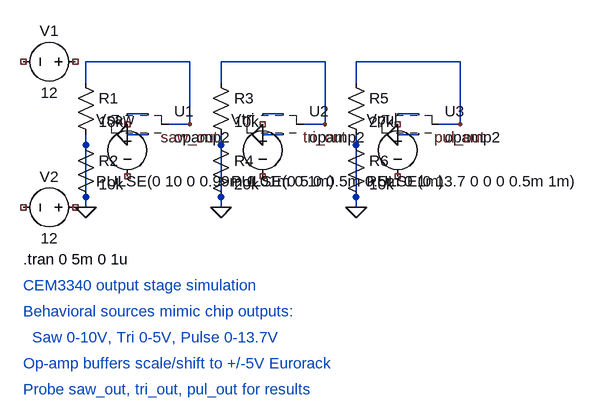
[diagram p0: schematic cem3340-output-stage.asc]
cem3340-output-stage.asc, the LTspice schematic file:
Version 4
SHEET 1 1600 900
WIRE 192 160 192 128
WIRE 192 272 192 240
WIRE 400 160 400 128
WIRE 400 272 400 240
WIRE 608 160 608 128
WIRE 608 272 608 240
WIRE 288 208 256 208
WIRE 288 240 256 240
WIRE 496 208 464 208
WIRE 496 240 464 240
WIRE 704 208 672 208
WIRE 704 240 672 240
WIRE 192 352 192 272
WIRE 400 352 400 272
WIRE 608 352 608 272
WIRE 352 224 320 224
WIRE 560 224 528 224
WIRE 768 224 736 224
WIRE 352 128 352 224
WIRE 352 128 192 128
WIRE 560 128 560 224
WIRE 560 128 400 128
WIRE 768 128 768 224
WIRE 768 128 608 128
FLAG 192 352 0
FLAG 400 352 0
FLAG 608 352 0
FLAG 256 240 0
FLAG 464 240 0
FLAG 672 240 0
FLAG 352 224 saw_out
FLAG 560 224 tri_out
FLAG 768 224 pul_out
SYMBOL opamp2 288 224 R0
SYMATTR InstName U1
SYMATTR Value2 Avol=100K GBW=3Meg Slew=13Meg
SYMBOL opamp2 496 224 R0
SYMATTR InstName U2
SYMATTR Value2 Avol=100K GBW=3Meg Slew=13Meg
SYMBOL opamp2 704 224 R0
SYMATTR InstName U3
SYMATTR Value2 Avol=100K GBW=3Meg Slew=13Meg
SYMBOL res 176 144 R0
SYMATTR InstName R1
SYMATTR Value 10k
SYMBOL res 176 240 R0
SYMATTR InstName R2
SYMATTR Value 10k
SYMBOL res 384 144 R0
SYMATTR InstName R3
SYMATTR Value 10k
SYMBOL res 384 240 R0
SYMATTR InstName R4
SYMATTR Value 20k
SYMBOL res 592 144 R0
SYMATTR InstName R5
SYMATTR Value 27k
SYMBOL res 592 240 R0
SYMATTR InstName R6
SYMATTR Value 10k
SYMBOL voltage 256 208 R0
WINDOW 0 -48 8 Left 2
WINDOW 3 -48 104 Left 2
SYMATTR InstName Vsaw
SYMATTR Value PULSE(0 10 0 0.99m 0.01m 0 1m)
SYMBOL voltage 464 208 R0
WINDOW 0 -48 8 Left 2
WINDOW 3 -48 104 Left 2
SYMATTR InstName Vtri
SYMATTR Value PULSE(0 5 0 0.5m 0.5m 0 1m)
SYMBOL voltage 672 208 R0
WINDOW 0 -48 8 Left 2
WINDOW 3 -48 104 Left 2
SYMATTR InstName Vpul
SYMATTR Value PULSE(0 13.7 0 0 0 0.5m 1m)
SYMBOL voltage 192 128 R90
WINDOW 0 -32 56 VBottom 2
WINDOW 3 32 56 VTop 2
SYMATTR InstName V1
SYMATTR Value 12
SYMBOL voltage 192 352 R90
WINDOW 0 -32 56 VBottom 2
WINDOW 3 32 56 VTop 2
SYMATTR InstName V2
SYMATTR Value 12
TEXT 96 432 Left 2 !.tran 0 5m 0 1u
TEXT 96 472 Left 2 ;CEM3340 output stage simulation
TEXT 96 512 Left 2 ;Behavioral sources mimic chip outputs:
TEXT 96 552 Left 2 ;  Saw 0-10V, Tri 0-5V, Pulse 0-13.7V
TEXT 96 592 Left 2 ;Op-amp buffers scale/shift to +/-5V Eurorack
TEXT 96 632 Left 2 ;Probe saw_out, tri_out, pul_out for results

The netlist it stands for:
* cem3340-output-stage.asc
* U1: Avol=100K GBW=3Meg Slew=13Meg (symbol opamp2 not available, pin order unknown); nets seen at it: 0, N001, saw_out
* U2: Avol=100K GBW=3Meg Slew=13Meg (symbol opamp2 not available, pin order unknown); nets seen at it: 0, N002, tri_out
* U3: Avol=100K GBW=3Meg Slew=13Meg (symbol opamp2 not available, pin order unknown); nets seen at it: 0, N003, pul_out
R1 saw_out 0 10k
R2 0 0 10k
R3 tri_out 0 10k
R4 0 0 20k
R5 pul_out 0 27k
R6 0 0 10k
Vsaw NC_01 NC_02 PULSE(0 10 0 0.99m 0.01m 0 1m)
Vtri NC_03 NC_04 PULSE(0 5 0 0.5m 0.5m 0 1m)
Vpul NC_05 NC_06 PULSE(0 13.7 0 0 0 0.5m 1m)
V1 NC_07 NC_08 12
V2 NC_09 NC_10 12
.tran 0 5m 0 1u
* CEM3340 output stage simulation
* Behavioral sources mimic chip outputs:
*   Saw 0-10V, Tri 0-5V, Pulse 0-13.7V
* Op-amp buffers scale/shift to +/-5V Eurorack
* Probe saw_out, tri_out, pul_out for results
.backanno
.end